# Altium project TankNode-PrjPCB.PrjPcb
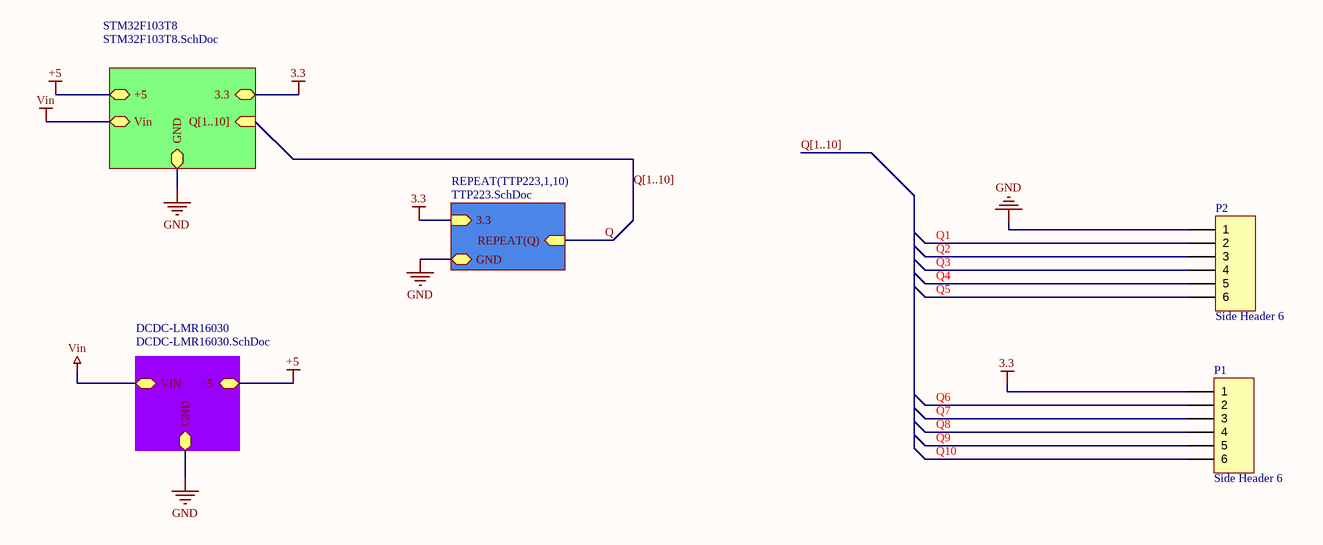
[diagram p0: TankNode-SchDoc.SchDoc]
Date: 2/2/2022; Engineer: Ehsan Shaghaei
3 sheets, 54 parts. Net scope: hierarchical (ports join the sheet entries above them; power ports are global).
Board file: TankNode-PcbDoc.PcbDoc
Sheets:
  TankNode-SchDoc.SchDoc
    DCDC-LMR16030 = DCDC-LMR16030.SchDoc
    TTP2231 = TTP223.SchDoc
    TTP2232 = TTP223.SchDoc
    TTP2233 = TTP223.SchDoc
    TTP2234 = TTP223.SchDoc
    TTP2235 = TTP223.SchDoc
    TTP2236 = TTP223.SchDoc
    TTP2237 = TTP223.SchDoc
    TTP2238 = TTP223.SchDoc
    TTP2239 = TTP223.SchDoc
    TTP22310 = TTP223.SchDoc

## Sheet TankNode-SchDoc.SchDoc
size 431 x 279 mm; SheetNumber: 1; SheetTotal: 4

### Parts
P1  Side Header 6  [6pin 1.5pitch]
P2  Side Header 6  [6pin 1.5pitch]

### Sub-sheets
DCDC-LMR16030 = DCDC-LMR16030.SchDoc: GND (bidir), VIN (bidir), +5 (bidir)
REPEAT(TTP223,1,10) = TTP223.SchDoc: GND (bidir), 3.3 (in), REPEAT(Q) (in)
STM32F103T8 = STM32F103T8.SchDoc (file not in this document): GND (bidir), +5 (bidir), 3.3 (bidir), Vin (bidir), Q[1..10] (in)

### Nets
3.3: P1.1 ; sheet STM32F103T8/3.3, sheet REPEAT(TTP223,1,10)/3.3
+5: sheet DCDC-LMR16030/+5, sheet STM32F103T8/+5
GND: P2.1 ; sheet DCDC-LMR16030/GND, sheet STM32F103T8/GND, sheet REPEAT(TTP223,1,10)/GND
Vin: sheet DCDC-LMR16030/VIN, sheet STM32F103T8/Vin
Q: sheet REPEAT(TTP223,1,10)/REPEAT(Q)
Q1: P2.2
Q2: P2.3
Q3: P2.4
Q4: P2.5
Q5: P2.6
Q6: P1.2
Q7: P1.3
Q8: P1.4
Q9: P1.5
Q10: P1.6

### Buses and harness runs
bus Q[1..10]
bus Q[1..10] = sheet STM32F103T8/Q[1..10]

### Notes on the sheet
- DWG. NO.
- REV.
- SHT.
- THIS DOCUMENT AND THE DATA DISCLOSED HEREIN OR HEREWITH IS THE PROPERTY OF ALTIUM LIMITED AND MAY BE FREELY DISTRIBUTED IN WHOLE. NO RIGHTS ARE RESERVED OR EXPRESS OR IMPLIED WARANTEE GIVEN.
- REVISION
- DESCRIPTION
- DATE
- APPROVED
- ENG:
- APPROVALS
- PROJECT
- DSN:
- CHK:
- REFERENCE DOCUMENTS
- PROJECT REVISION:
- TITLE
- DOCUMENT REVISION:
- DESIGN ITEM:
- BOM:
- FAB DWG:
- PCB DWG:
- ASSY DWG:
- SCALE:
- SIZE
- B
- CAGE CODE
- FILE NAME
- DWG NO.
- SHEET
- OF
- REV

### Library data of the parts
P1 P2 = Side Header 6: Header, 4-Pin; LatestRevisionDate: 17-Jul-2002; LatestRevisionNote: Re-released for DXP Platform.; Publisher: Altium Limited

## Sheet DCDC-LMR16030.SchDoc
size A3; Engineer: Ehsan Shaghaei; Revision: 9; SheetNumber: 2; SheetTotal: 4
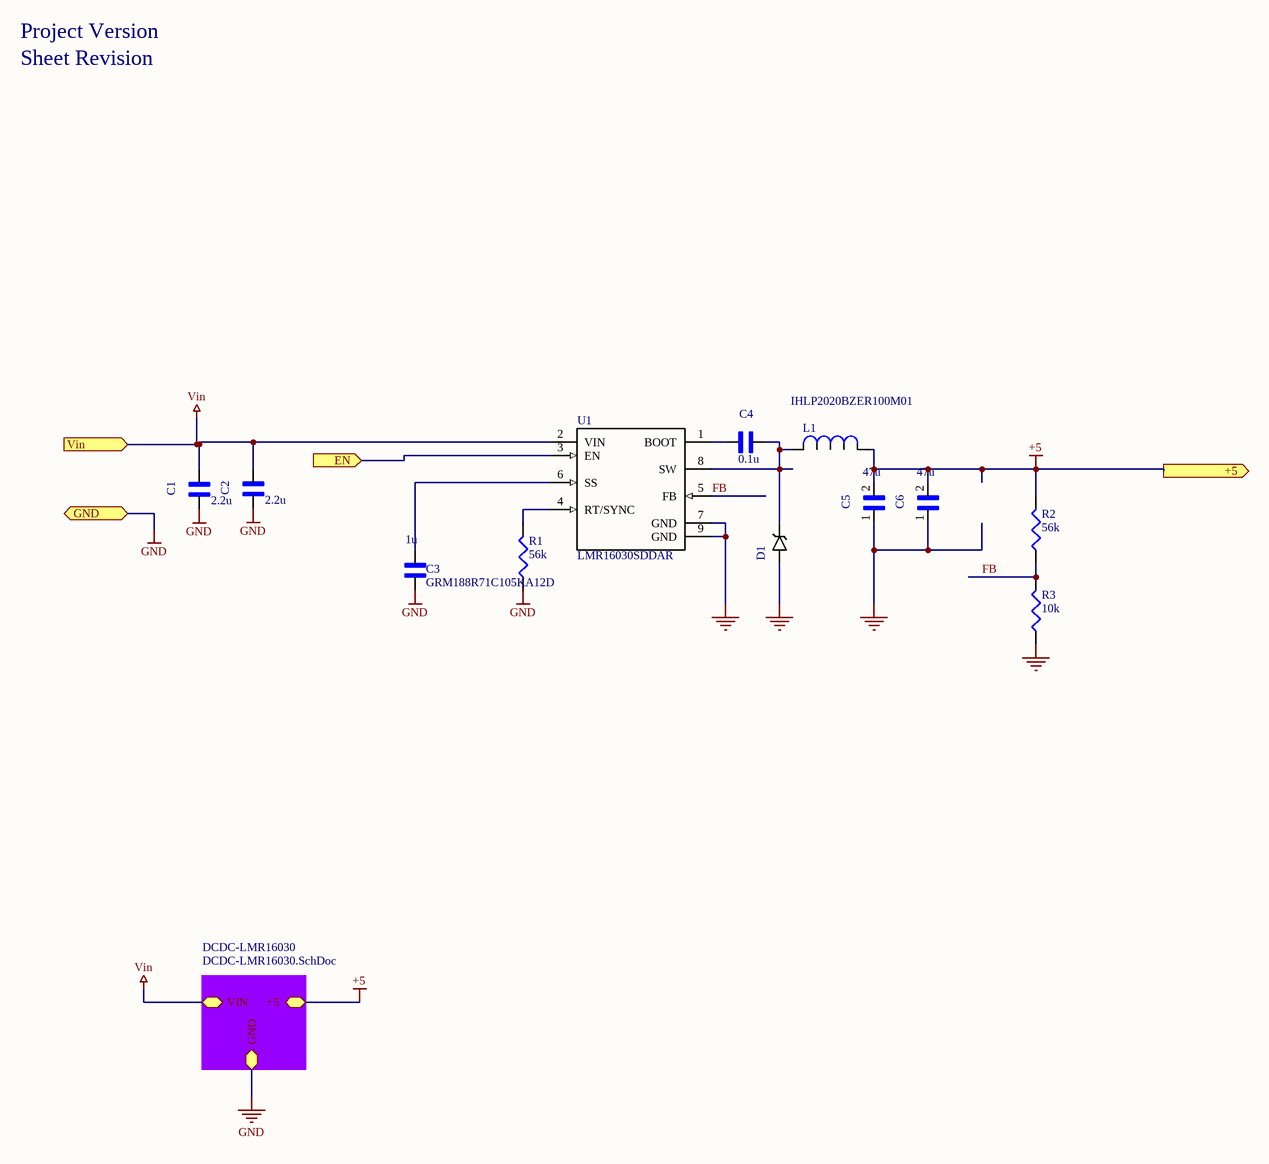
[diagram p1: DCDC-LMR16030.SchDoc]

### Parts
C1  value 2.2u  [*CAP3216X125N]  (hidden comment: GRM31CR71H225KA88L)
C2  value 2.2u  [*CAP3216X125N]  (hidden comment: GRM31CR71H225KA88L)
C3  GRM188R71C105KA12D  value 1u  [CAPC1608X90N]
C4  value 0.1u  [*CAPC1608X90]  (hidden comment: GX035C104MAT2-500)
C5  value 47u  [*CAPC3216X125N]  (hidden comment: GRM31CR61A476KE15L)
C6  value 47u  [*CAPC3216X125N]  (hidden comment: GRM31CR61A476KE15L)
D1  SK56  [*SMB_P6SMB62AT3G(Primary)]  (value not drawn)
L1  IHLP2020BZER100M01  [IHLP]
R1  value 56k  [J1-0603]  (hidden comment: Res3)
R2  value 56k  [J1-0603]  (hidden comment: Res3)
R3  value 10k  [J1-0603]  (hidden comment: RC0603FR-0710KL)
U1  LMR16030SDDAR  [*SOIC127P600X170-9N - duplicate]

### Sub-sheets
DCDC-LMR16030 = DCDC-LMR16030.SchDoc: GND (bidir), VIN (bidir), +5 (bidir)

### Ports
+5 (out), EN (in), GND (bidir), Vin (in)

### Nets
+5: C5.2 C6.2 L1.1 R2.2 ; port +5, sheet DCDC-LMR16030/+5
GND: C1.2 C2.2 C3.1 C5.1 C6.1 D1.A R1.1 R3.1 U1.7(GND) U1.9(GND) ; port GND, sheet DCDC-LMR16030/GND
Vin: C1.1 C2.1 U1.2(VIN) ; port Vin, sheet DCDC-LMR16030/VIN
FB: R2.1 R3.2 U1.5(FB)
NetC3_2: C3.2 U1.6(SS)
NetC4_1: C4.1 D1.C L1.2 U1.8(SW)
NetC4_2: C4.2 U1.1(BOOT)
NetR1_2: R1.2 U1.4(RT/SYNC)
NetU1_3: U1.3(EN) ; port EN

### Notes on the sheet
- Project Version
- Sheet Revision

### Library data of the parts
C1 C2 = GRM31CR71H225KA88L: 1206 2.2 uF 50 V В±10% Tolerance X7R SMT Multilayer Ceramic Capacitor; MF: Murata Electronics; Type: SMD; Package: 1206 Murata; SnapEDA_Link: https://www.snapeda.com/parts/GRM31CR71H225KA88L/Murata%20Electronics%20North%20America/view-part/?ref=snap; MP: GRM31CR71H225KA88L
C3 = GRM188R71C105KA12D: SMD Capacitor X7R(EIA) with Capacitance: 1.0uF Tol. 10%. Rated Voltage: 16Vdc; MF: Murata Electronics; Pacage Metric: 1608; MP: GRM188R71C105KA12D; SnapEDA_Link: https://www.snapeda.com/parts/GRM188R71C105KA12D/Murata%20Electronics%20North%20America/view-part/228340/?ref=snap; Package: 0603; ChipDip_Link: https://www.chipdip.ru/product/grm188r71c105ka12d; HelpURL: https://static.chipdip.ru/lib/428/DOC005428493.pdf; Type: SMD
C4 = GX035C104MAT2-500: Cap Thin Film 0.1uf 50v 0603; MF: AVX; MP: GX035C104MAT2-500 or CL10B104JB8NNNC; Pacage Metric: 1608; Type: SMD; Package: 0603 AVX; SnapEDA_Link: https://www.snapeda.com/parts/GX035C104MAT2-500/AVX/view-part/?ref=snap
C5 C6 = GRM31CR61A476KE15L: Multilayer Ceramic Capacitor, GRM Series, 47 - F, - 10%, X5R, 10 V, 1206 [3216 Metric]; MF: Murata Electronics; Type: SMD; Package: 1206 Murata Electronics; MP: GRM31CR61A476KE15L; SnapEDA_Link: https://www.snapeda.com/parts/GRM31CR61A476KE15L/Murata%20Electronics%20North%20America/view-part/?ref=snap
D1 = SK56: Диод Шоттки 5А 60В [SMB / DO-214AA]; MF: Littelfuse Inc.; Type: SMD; MP: SK56; Package: DO-214 Littelfuse; SnapEDA_Link: https://www.snapeda.com/parts/P6SMB62AT3G/Littelfuse%20Inc./view-part/?ref=snap; Value: *; ChipDip_Link: https://www.chipdip.ru/product/sk56
L1 = IHLP2020BZER100M01: 10ÂµH Shielded Molded Inductor 2.3A 199mOhm Max Nonstandard; MF: Vishay Dale; Type: SMD; SnapEDA_Link: https://www.snapeda.com/parts/IHLP2020BZER100M01/Vishay%20Dale/view-part/44808/?ref=snap; MP: IHLP2020BZER100M01; Value: *; Package: Nonstandard Vishay; HelpURL: http://www.vishay.com/docs/34253/ihlp-2020bz-01.pdf; ChipDip_Link: https://www.chipdip.ru/product/ihlp2020bzer100m11-inductor-ihlp-smd-2020-10
R1 R2 = Res3: Resistor; Pacage Metric: 1608; MP: RC0603FR-0756KL; ChipDip_Link: https://www.chipdip.ru/product0/9000079754; HelpURL: https://www.chipdip.ru/product0/9000079754; Package: R0603; Type: SMD
R3 = RC0603FR-0710KL: 10 kOhms 1 0.1 W 1 10 W Chip Resistor 0603 1608 Metric Thick Film; Pacage Metric: 1608; MF: Yageo or NXP; MP: 10K 1% 0603; ChipDip_Link: https://www.chipdip.ru/product0/9000079736; HelpURL: https://www.chipdip.ru/product0/9000079736; Package: R0603; Type: SMD; SnapEDA_Link: https://www.snapeda.com/parts/RC0603FR-0710KL/Yageo/view-part/?ref=dk&t=RC0603FR-0710KL&con_ref=None
U1 = LMR16030SDDAR: LMR16030SDDAR, Conv DC-DC 4.3V to 60V Step Down Single-Out 1V to 50V 3A Automotive 8-Pin HSOP EP T/R; MF: Texas Instruments; SnapEDA_Link: https://www.snapeda.com/parts/TPS54560DDA/Texas%20Instruments/view-part/?ref=snap; MP: LMR16030SDDAR; Package: PowerSOIC-8 Texas Instruments; Value: *; Type: SMD; ChipDip_Link: https://www.chipdip.ru/product1/8003448566; HelpURL: https://www.ti.com/lit/ds/symlink/lmr16030.pdf

## Sheet TTP223.SchDoc
size A; SheetNumber: 4; SheetTotal: 4
Used 10 times, as channels TTP2231, TTP2232, TTP2233, TTP2234, TTP2235, TTP2236, TTP2237, TTP2238, TTP2239, TTP22310. Parts and nets are listed once, with the designators drawn on the sheet.
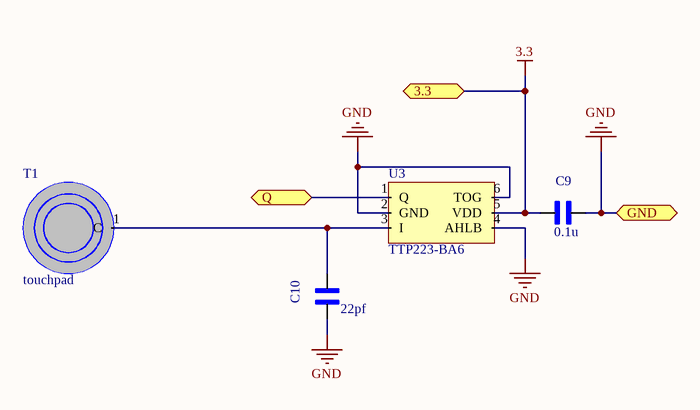
[diagram p2: TTP223.SchDoc]

### Parts
C9  value 0.1u  [*CAPC1608X90]  (hidden comment: GX035C104MAT2-500)
C10  value 22pf  [*CAPC1608X90]  (hidden comment: GX035C104MAT2-500)
T1  touchpad  [TANKSENSOR]
U3  TTP223-BA6  [SOT23-6]

### Ports
3.3 (bidir), GND (bidir), Q (bidir)

### Nets
3.3: C9.2 U3.5(VDD) ; port 3.3
GND: C9.1 C10.2 U3.2(GND) U3.4(AHLB) U3.6(TOG) ; port GND
Q: U3.1(Q) ; port Q
NetC10_1: C10.1 T1.1(C) U3.3(I)

### Channels
TTP2231: designators end in .1; ports 3.3=3.3 GND=GND Q=Q1
TTP2232: designators end in .2; ports 3.3=3.3 GND=GND Q=Q2
TTP2233: designators end in .3; ports 3.3=3.3 GND=GND Q=Q3
TTP2234: designators end in .4; ports 3.3=3.3 GND=GND Q=Q4
TTP2235: designators end in .5; ports 3.3=3.3 GND=GND Q=Q5
TTP2236: designators end in .6; ports 3.3=3.3 GND=GND Q=Q6
TTP2237: designators end in .7; ports 3.3=3.3 GND=GND Q=Q7
TTP2238: designators end in .8; ports 3.3=3.3 GND=GND Q=Q8
TTP2239: designators end in .9; ports 3.3=3.3 GND=GND Q=Q9
TTP22310: designators end in .10; ports 3.3=3.3 GND=GND Q=Q10

### Library data of the parts
C9 C10 = GX035C104MAT2-500: as C4 on sheet DCDC-LMR16030; Package: 0603 AVX; SnapEDA_Link: https://www.snapeda.com/parts/GX035C104MAT2-500/AVX/view-part/?ref=snap
U3 = TTP223-BA6: HelpURL: https://static.chipdip.ru/lib/928/DOC012928792.pdf; Chipdip_Link: https://www.chipdip.ru/product/ttp223

## Nets that join several sheets
3.3: TankNode-SchDoc (P1.1), TTP2231 (C9.1.2 U3.1.5), TTP2232 (C9.2.2 U3.2.5), TTP2233 (C9.3.2 U3.3.5), TTP2234 (C9.4.2 U3.4.5), TTP2235 (C9.5.2 U3.5.5), TTP2236 (C9.6.2 U3.6.5), TTP2237 (C9.7.2 U3.7.5), TTP2238 (C9.8.2 U3.8.5), TTP2239 (C9.9.2 U3.9.5), TTP22310 (C9.10.2 U3.10.5)
GND: TankNode-SchDoc (P2.1), DCDC-LMR16030 (10 pins), TTP2231 (5 pins), TTP2232 (5 pins), TTP2233 (5 pins), TTP2234 (5 pins), TTP2235 (5 pins), TTP2236 (5 pins), TTP2237 (5 pins), TTP2238 (5 pins), TTP2239 (5 pins), TTP22310 (5 pins)
Q1: TankNode-SchDoc (P2.2), TTP2231 (U3.1.1)
Q2: TankNode-SchDoc (P2.3), TTP2232 (U3.2.1)
Q3: TankNode-SchDoc (P2.4), TTP2233 (U3.3.1)
Q4: TankNode-SchDoc (P2.5), TTP2234 (U3.4.1)
Q5: TankNode-SchDoc (P2.6), TTP2235 (U3.5.1)
Q6: TankNode-SchDoc (P1.2), TTP2236 (U3.6.1)
Q7: TankNode-SchDoc (P1.3), TTP2237 (U3.7.1)
Q8: TankNode-SchDoc (P1.4), TTP2238 (U3.8.1)
Q9: TankNode-SchDoc (P1.5), TTP2239 (U3.9.1)
Q10: TankNode-SchDoc (P1.6), TTP22310 (U3.10.1)